# EAGLE design ic-mhm-encoder-buffer-output-only (EAGLE 9.6.2)
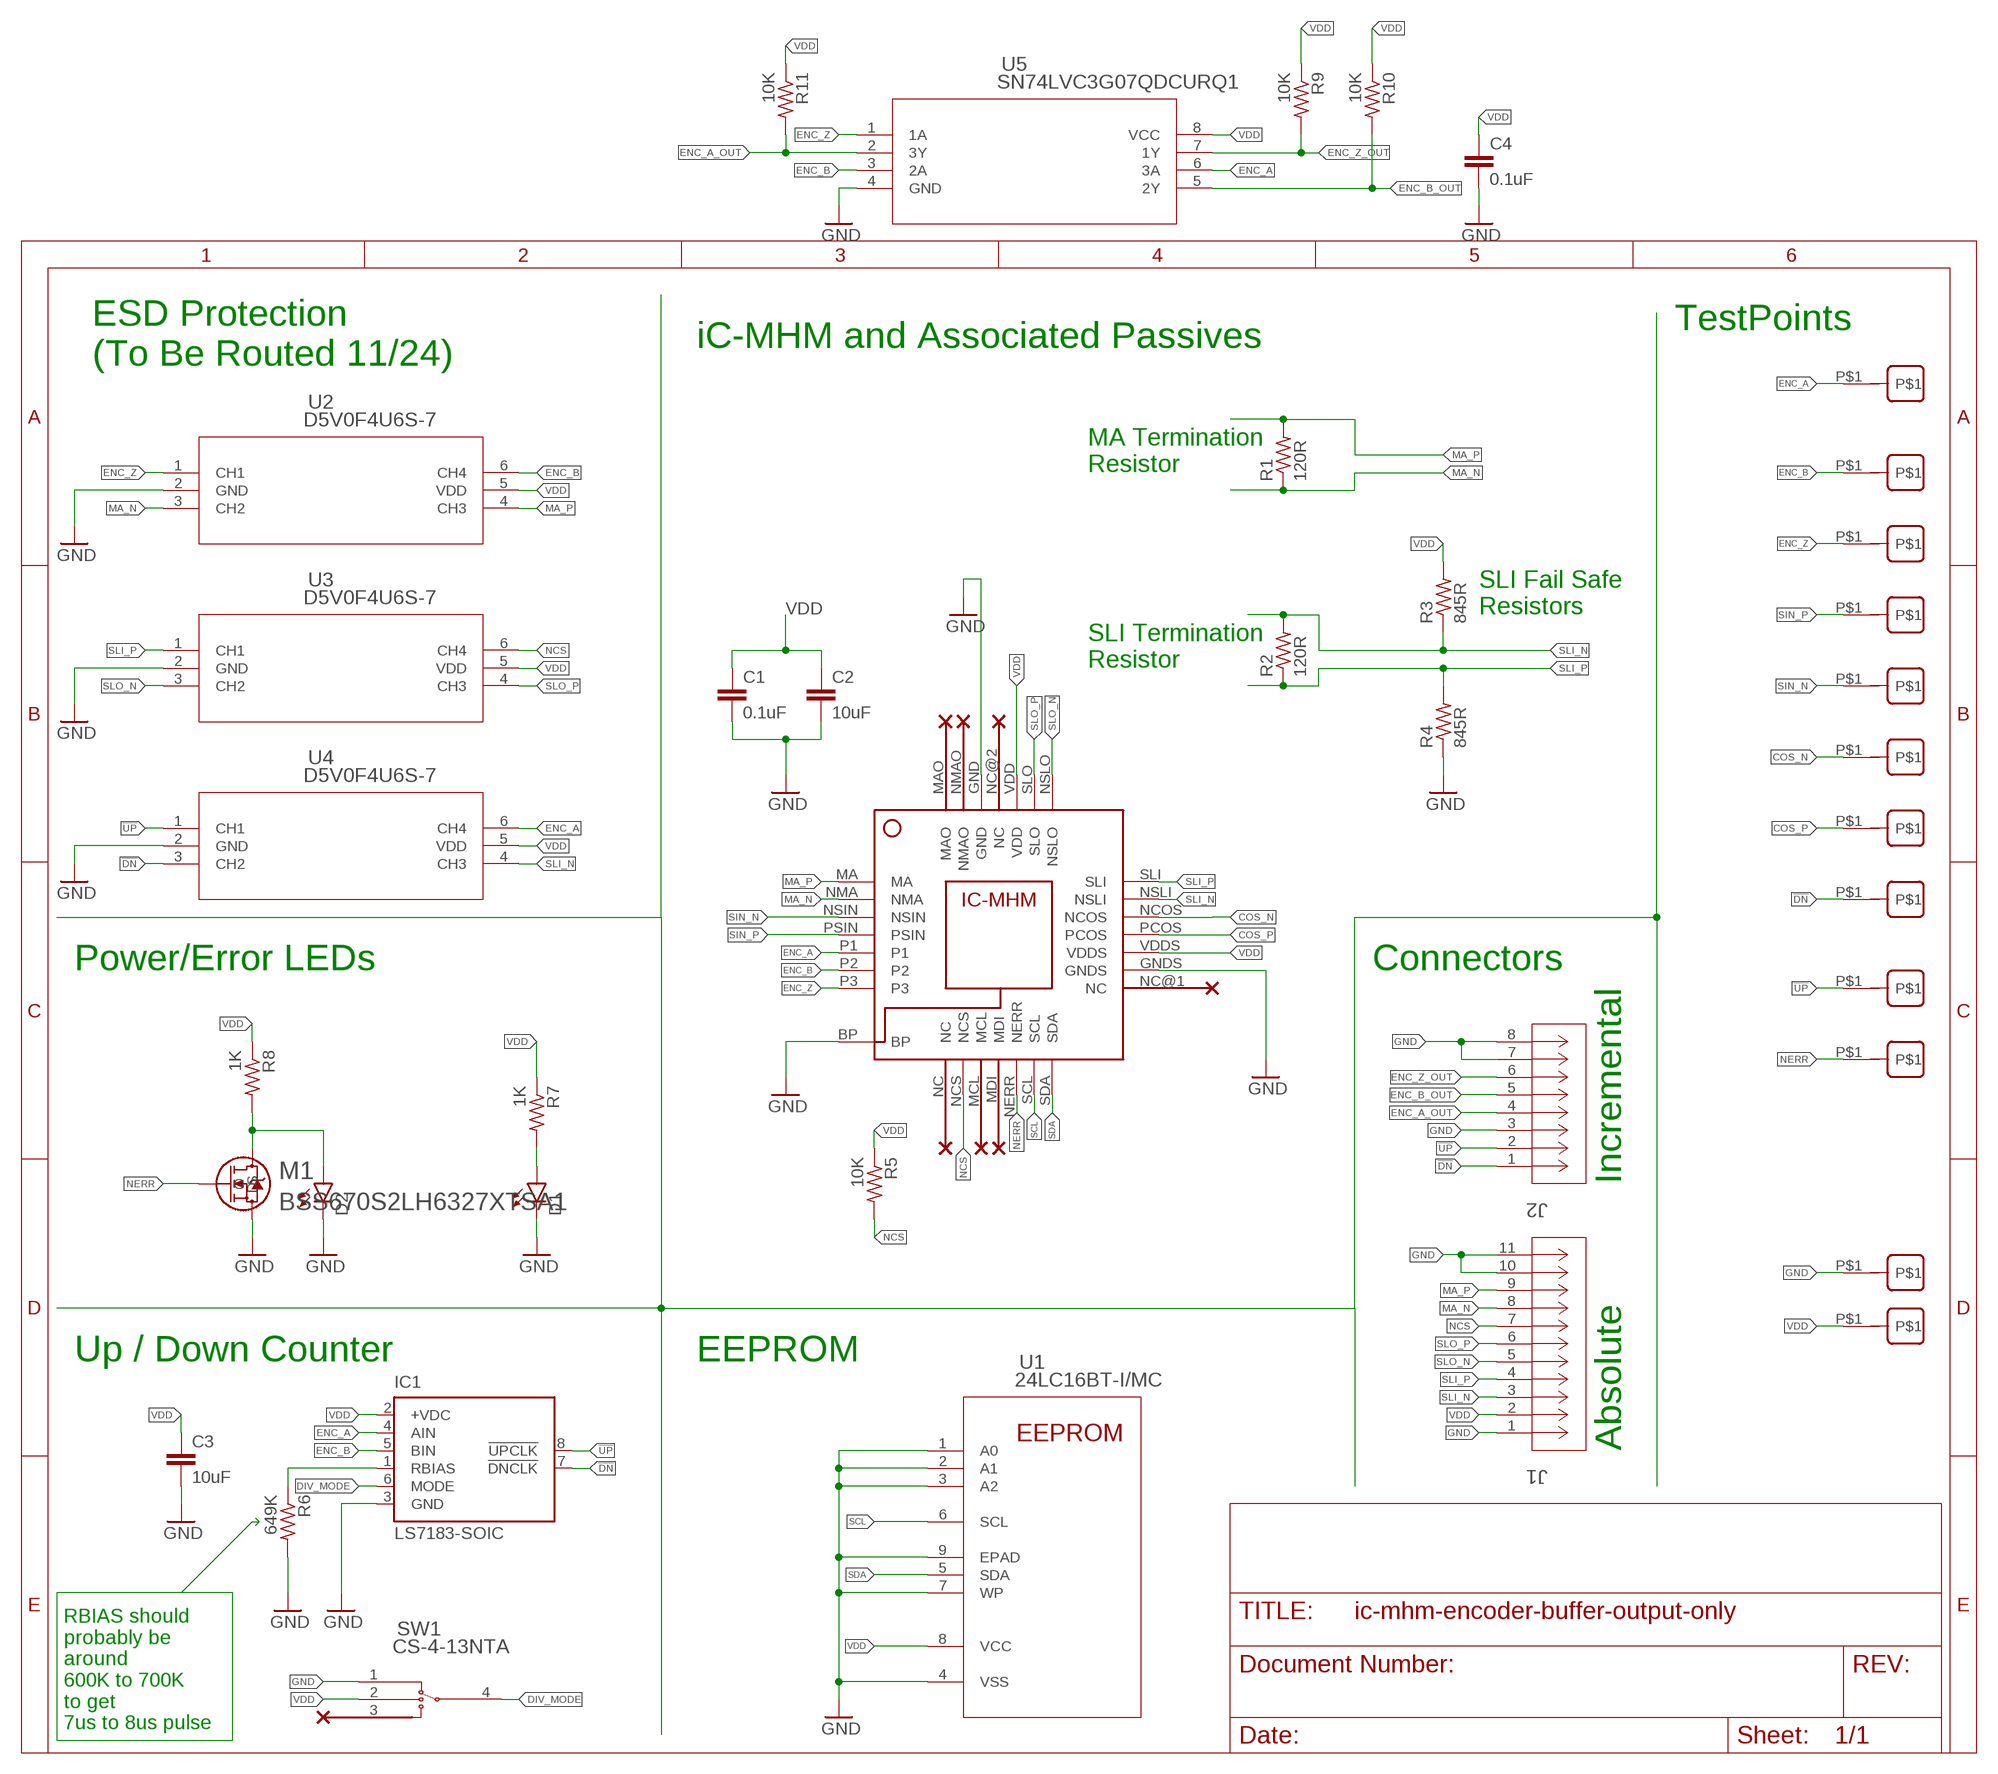
[diagram p0: schematic, sheet 1]

## Parts
C1  0.1uF  C-EUC0603  [C0603]
C2  10uF  C-EUC0805  [C0805]
C3  10uF  C-EUC0805  [C0805]
C4  0.1uF  C-EUC0603  [C0603]
D1  LEDSML0603  [SML0603]
D2  LEDSML0603  [SML0603]
IC1  LS7183-SOIC  [SOIC08]
J1  2023960907  [CON_2023960907]
J2  2023960607  [CON_2023960607]
M1  BSS670S2LH6327XTSA1  [PG-SOT23-3-5_INF]
R1  120R  R-US_R0603  [R0603]
R2  120R  R-US_R0603  [R0603]
R3  845R  R-US_R0603  [R0603]
R4  845R  R-US_R0603  [R0603]
R5  10K  R-US_R0603  [R0603]
R6  649K  R-US_R0603  [R0603]
R7  1K  R-US_R0603  [R0603]
R8  1K  R-US_R0603  [R0603]
R9  10K  R-US_R0603  [R0603]
R10  10K  R-US_R0603  [R0603]
R11  10K  R-US_R0603  [R0603]
SW1  CS-4-13NTA  [CS-4-13NA_NDC]
U1  24LC16BT-I/MC  [DFN8_2X3MC_MCH]
U2  D5V0F4U6S-7  [SOT-363_DIO]
U3  D5V0F4U6S-7  [SOT-363_DIO]
U4  D5V0F4U6S-7  [SOT-363_DIO]
U5  SN74LVC3G07QDCURQ1  [DCU8_TEX]
U$1  IC-MHM  [IC-MHM]
U$2  TESTPOINT_S1751-46  [TESTPOINT_S1751-46]
U$3  TESTPOINT_S1751-46  [TESTPOINT_S1751-46]
U$4  TESTPOINT_S1751-46  [TESTPOINT_S1751-46]
U$5  TESTPOINT_S1751-46  [TESTPOINT_S1751-46]
U$6  TESTPOINT_S1751-46  [TESTPOINT_S1751-46]
U$7  TESTPOINT_S1751-46  [TESTPOINT_S1751-46]
U$8  TESTPOINT_S1751-46  [TESTPOINT_S1751-46]
U$9  TESTPOINT_S1751-46  [TESTPOINT_S1751-46]
U$10  TESTPOINT_S1751-46  [TESTPOINT_S1751-46]
U$11  TESTPOINT_S1751-46  [TESTPOINT_S1751-46]
U$15  TESTPOINT_S1751-46  [TESTPOINT_S1751-46]
U$16  TESTPOINT_S1751-46  [TESTPOINT_S1751-46]

## Nets
!DN: IC1.7(!DNCLK) J2.1 U4.3(CH2) U$8.P$1
!UP: IC1.8(!UPCLK) J2.2 U4.1(CH1) U$9.P$1
COS_N [RS422]: U$1.NCOS U$7.P$1
COS_P [RS422]: U$1.PCOS U$11.P$1
DIV_MODE: IC1.6(MODE) SW1.4
ENC_A: IC1.4(AIN) U4.6(CH4) U5.6(3A) U$1.P1 U$2.P$1
ENC_A_OUT: J2.4 R11.2 U5.2(3Y)
ENC_B: IC1.5(BIN) U2.6(CH4) U5.3(2A) U$1.P2 U$3.P$1
ENC_B_OUT: J2.5 R10.2 U5.5(2Y)
ENC_Z: U2.1(CH1) U5.1(1A) U$1.P3 U$4.P$1
ENC_Z_OUT: J2.6 R9.2 U5.7(1Y)
GND: C1.2 C2.2 C3.2 C4.2 D1.C D2.C IC1.3(GND) J1.1 J1.10 J1.11 J2.3 J2.7 J2.8 M1.2(S) R4.1 R6.2 SW1.1 U1.1(A0) U1.2(A1) U1.3(A2) U1.4(VSS) U1.7(WP) U1.9(EPAD) U2.2(GND) U3.2(GND) U4.2(GND) U5.4(GND) U$1.BP U$1.GND U$1.GNDS U$15.P$1
MA_N [RS422]: J1.8 R1.1 U2.3(CH2) U$1.NMA
MA_P [RS422]: J1.9 R1.2 U2.4(CH3) U$1.MA
N$3: IC1.1(RBIAS) R6.1
N$4: D1.A R7.2
N$5: D2.A M1.3(D) R8.2
NCS: J1.7 R5.2 U3.6(CH4) U$1.NCS
NERR: M1.1(G) U$1.NERR U$10.P$1
SCL: U1.6(SCL) U$1.SCL
SDA: U1.5(SDA) U$1.SDA
SIN_N [RS422]: U$1.NSIN U$6.P$1
SIN_P [RS422]: U$1.PSIN U$5.P$1
SLI_N [RS422]: J1.3 R2.2 R3.1 U4.4(CH3) U$1.NSLI
SLI_P [RS422]: J1.4 R2.1 R4.2 U3.1(CH1) U$1.SLI
SLO_N [RS422]: J1.5 U3.3(CH2) U$1.NSLO
SLO_P [RS422]: J1.6 U3.4(CH3) U$1.SLO
VDD: C1.1 C2.1 C3.1 C4.1 IC1.2(+VDC) J1.2 R3.2 R5.1 R7.1 R8.1 R9.1 R10.1 R11.1 SW1.2 U1.8(VCC) U2.5(VDD) U3.5(VDD) U4.5(VDD) U5.8(VCC) U$1.VDD U$1.VDDS U$16.P$1
Unconnected: SW1.3 U$1.MAO U$1.MCL U$1.MDI U$1.NC U$1.NC@1(NC) U$1.NC@2(NC) U$1.NMAO

## Notes on the sheet
- TestPoints
- iC-MHM and Associated Passives
- ESD Protection
  (To Be Routed 11/24)
- MA Termination
  Resistor
- SLI Fail Safe 
  Resistors
- SLI Termination
  Resistor
- Power/Error LEDs | Connectors
- Incremental
- Up / Down Counter | EEPROM
- Absolute
- RBIAS should 
  probably be 
  around 
  600K to 700K
  to get 
  7us to 8us pulse

## Library data of the parts
C1-C4 = rcl:C-EU: CAPACITOR, European symbol; SPICEPREFIX: C
D1 D2 = led:LED: LED OSRAM: - CHIPLED LG R971, LG N971, LY N971, LG Q971, LY Q971, LO R971, LY R971 LH N974, LH R974 LS Q976, LO Q976, LY Q976 LO Q996 - Hyper CHIPLED LW Q18S LB Q993, LB Q99A, LB R99A - SideLED LS A670, LO A670, LY A670, LG A670, LP A670 LB A673, LV A673, LT A673, LW A673 LH A674 LY A675 LS A676, LA A676, LO A676, LY A676, LW A676 LS A679, LY A679, LG A679 - Hyper Micro SIDELED® LS Y876, LA Y876, LO Y876, LY Y876 LT Y87S - SmartLED LW L88C, LW L88S LB L89C, LB L89S, LG L890 LS L89K, LO L89K, LY L89K LS L896, LA L896, LO L896, LY L896 - TOPLED LS T670, LO T670, LY T670, LG T670, LP T670 LSG T670, LSP T670, LSY T670, LOP T670, LYG T670 LG T671, LOG T671, LSG T671 LB T673, LV T673, LT T673, LW T673 LH T674 LS T676, LA T676, LO T676, LY T676, LB T676, LH T676, LSB T676, LW T676 LB T67C, LV T67C, LT T67C, LS T67K, LO T67K, LY T67K, LW E67C LS E67B, LA E67B, LO E67B, LY E67B, LB E67C, LV E67C, LT E67C LW T67C LS T679, LY T679, LG T679 LS T770, LO T770, LY T770, LG T770, LP T770 LB T773, LV T773, LT T773, LW T773 LH T774 LS E675, LA E675, LY E675, LS T675 LS T776, LA T776, LO T776, LY T776, LB T776 LHGB T686 LT T68C, LB T68C - Hyper Mini TOPLED® LB M676 - Mini TOPLED Santana® LG M470 LS M47K, LO M47K, LY M47K Source: http://www.osram.convergy.de LUXEON: - LUMILED® LXK2-PW12-R00, LXK2-PW12-S00, LXK2-PW14-U00, LXK2-PW14-V00 LXK2-PM12-R00, LXK2-PM12-S00, LXK2-PM14-U00 LXK2-PE12-Q00, LXK2-PE12-R00, LXK2-PE12-S00, LXK2-PE14-T00, LXK2-PE14-U00 LXK2-PB12-K00, LXK2-PB12-L00, LXK2-PB12-M00, LXK2-PB14-N00, LXK2-PB14-P00, LXK2-PB14-Q00 LXK2-PR12-L00, LXK2-PR12-M00, LXK2-PR14-Q00, LXK2-PR14-R00 LXK2-PD12-Q00, LXK2-PD12-R00, LXK2-PD12-S00 LXK2-PH12-R00, LXK2-PH12-S00 LXK2-PL12-P00, LXK2-PL12-Q00, LXK2-PL12-R00 Source: www.luxeon.com KINGBRIGHT: KA-3528ASYC Source: www.kingbright.com
IC1 = LS7183:LS7183: Encoder to Counter Interface Source: http://www.usdigital.com/products/ls7183-ls7184/ls7183 ls7184 Data Sheet.pdf; DESCRIPTION: QUADRATURE CLOCK CONVERTER; DIGI-KEY_PART_NUMBER: 2808-LS7183N-S-ND; MF: LSI; MP: LS7183; PACKAGE: SOIC-8 LSI; PURCHASE-URL: https://pricing.snapeda.com/search/part/LS7183/?ref=eda
J1 = ic-mhm:2023960907; COPYRIGHT: Copyright (C) 2021 Ultra Librarian. All rights reserved.; DIGI-KEY_PART_NUMBER_1: WM26786TR-ND; DIGI-KEY_PART_NUMBER_2: WM26786CT-ND; DIGI-KEY_PART_NUMBER_3: WM26786DKR-ND; MANUFACTURER_PART_NUMBER: 2023960907; MFR_NAME: Molex Connector Corporation
J2 = ic-mhm:2023960607; COPYRIGHT: Copyright (C) 2021 Ultra Librarian. All rights reserved.; DIGI-KEY_PART_NUMBER_1: 2023960607-ND; MANUFACTURER_PART_NUMBER: 2023960607; MFR_NAME: Molex Connector Corporation
M1 = ic-mhm:BSS670S2LH6327XTSA1; COPYRIGHT: Copyright (C) 2021 Ultra Librarian. All rights reserved.; DIGI-KEY_PART_NUMBER_1: BSS670S2LH6327XTSA1TR-ND; DIGI-KEY_PART_NUMBER_2: BSS670S2LH6327XTSA1CT-ND; DIGI-KEY_PART_NUMBER_3: BSS670S2LH6327XTSA1DKR-ND; MANUFACTURER_PART_NUMBER: BSS670S2LH6327XTSA1; MFR_NAME: Infineon
R1-R11 = rcl:R-US_: RESISTOR, American symbol; SPICEPREFIX: R
SW1 = ic-mhm:CS-4-13NTA; COPYRIGHT: Copyright (C) 2021 Ultra Librarian. All rights reserved.; DIGI-KEY_PART_NUMBER_1: 563-1035-1-ND; DIGI-KEY_PART_NUMBER_2: 563-1035-2-ND; DIGI-KEY_PART_NUMBER_3: 563-1035-6-ND; MANUFACTURER_PART_NUMBER: CS-4-13NTA; MFR_NAME: Nidec Copal Electronics
U1 = ic-mhm:24LC16BT-I/MC; COPYRIGHT: Copyright (C) 2021 Ultra Librarian. All rights reserved.; DIGI-KEY_PART_NUMBER_1: 24LC16BT-I/MCCT-ND; DIGI-KEY_PART_NUMBER_2: 24LC16BT-I/MCDKR-ND; DIGI-KEY_PART_NUMBER_3: 24LC16BT-I/MCTR-ND; MANUFACTURER_PART_NUMBER: 24LC16BT-I/MC; MFR_NAME: Microchip
U2-U4 = ic-mhm:D5V0F4U6S-7; COPYRIGHT: Copyright (C) 2021 Ultra Librarian. All rights reserved.; DIGI-KEY_PART_NUMBER_1: 31-D5V0F4U6S-7CT-ND; DIGI-KEY_PART_NUMBER_2: 31-D5V0F4U6S-7DKR-ND; DIGI-KEY_PART_NUMBER_3: 31-D5V0F4U6S-7TR-ND; DIGI-KEY_PART_NUMBER_4: D5V0F4U6S-7-ND; DIGI-KEY_PART_NUMBER_5: D5V0F4U6S-7DICT-ND; DIGI-KEY_PART_NUMBER_6: D5V0F4U6S-7DIDKR-ND; DIGI-KEY_PART_NUMBER_7: D5V0F4U6S-7DITR-ND; MANUFACTURER_PART_NUMBER: D5V0F4U6S-7; MFR_NAME: Diodes Inc
U5 = ic-mhm:SN74LVC3G07QDCURQ1; COPYRIGHT: Copyright (C) 2021 Ultra Librarian. All rights reserved.; DIGI-KEY_PART_NUMBER_1: 296-23710-1-ND; DIGI-KEY_PART_NUMBER_2: 296-23710-2-ND; DIGI-KEY_PART_NUMBER_3: 296-23710-6-ND; DIGI-KEY_PART_NUMBER_4: 2156-SN74LVC3G07QDCURQ1-ND; MANUFACTURER_PART_NUMBER: SN74LVC3G07QDCURQ1; MFR_NAME: Texas Instruments
U$1 = ic-mhm:IC-MHM
U$2-U$11 U$15 U$16 = ic-mhm:TESTPOINT_S1751-46

## Net classes
1 RS422: width 0.159 mm, clearance 0.254 mm

## Board
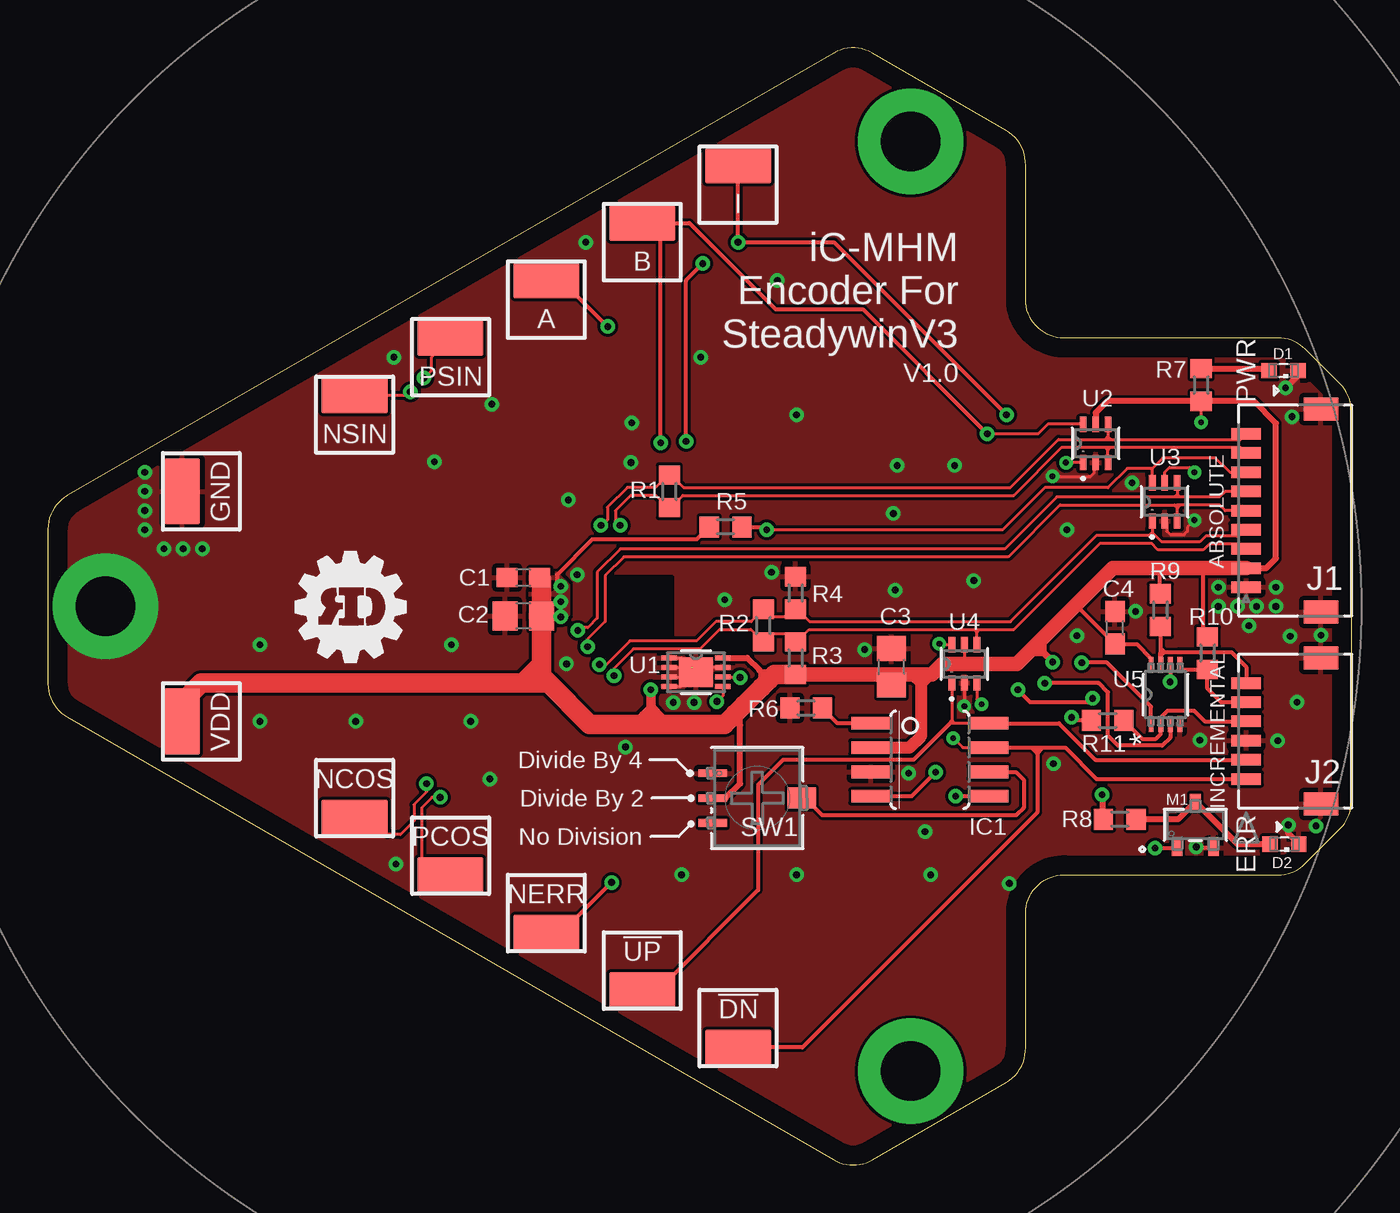
[diagram p1: board, top side]
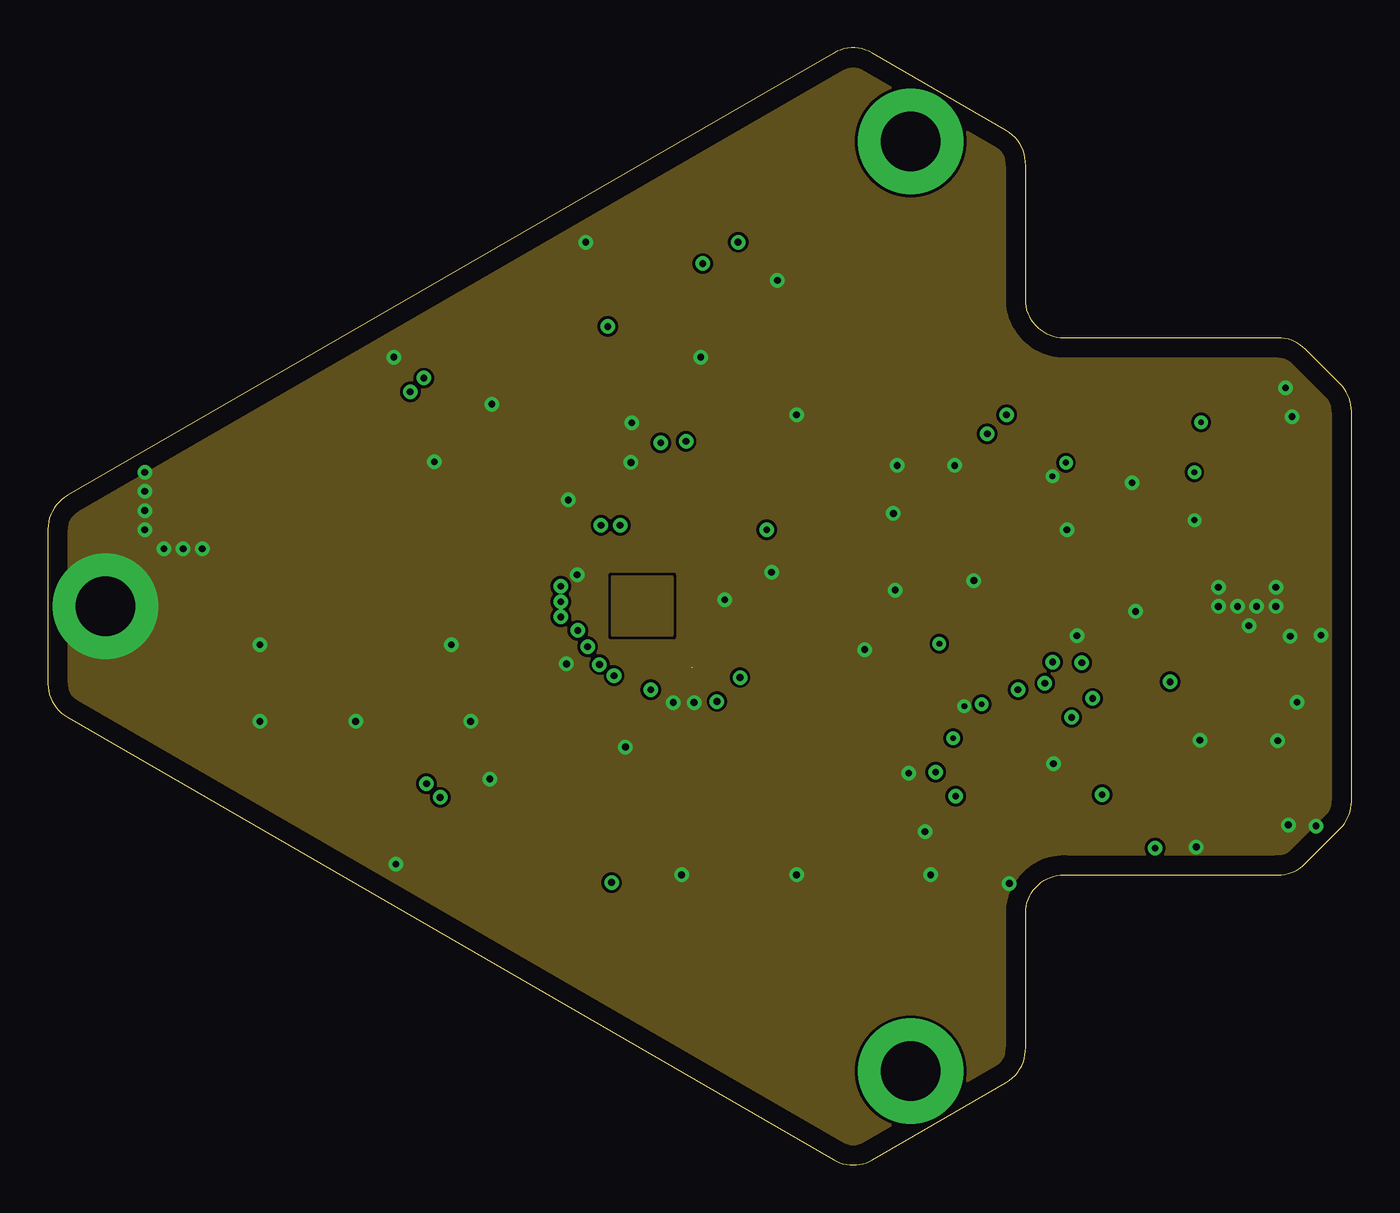
[diagram p2: board, inner layer Route2]
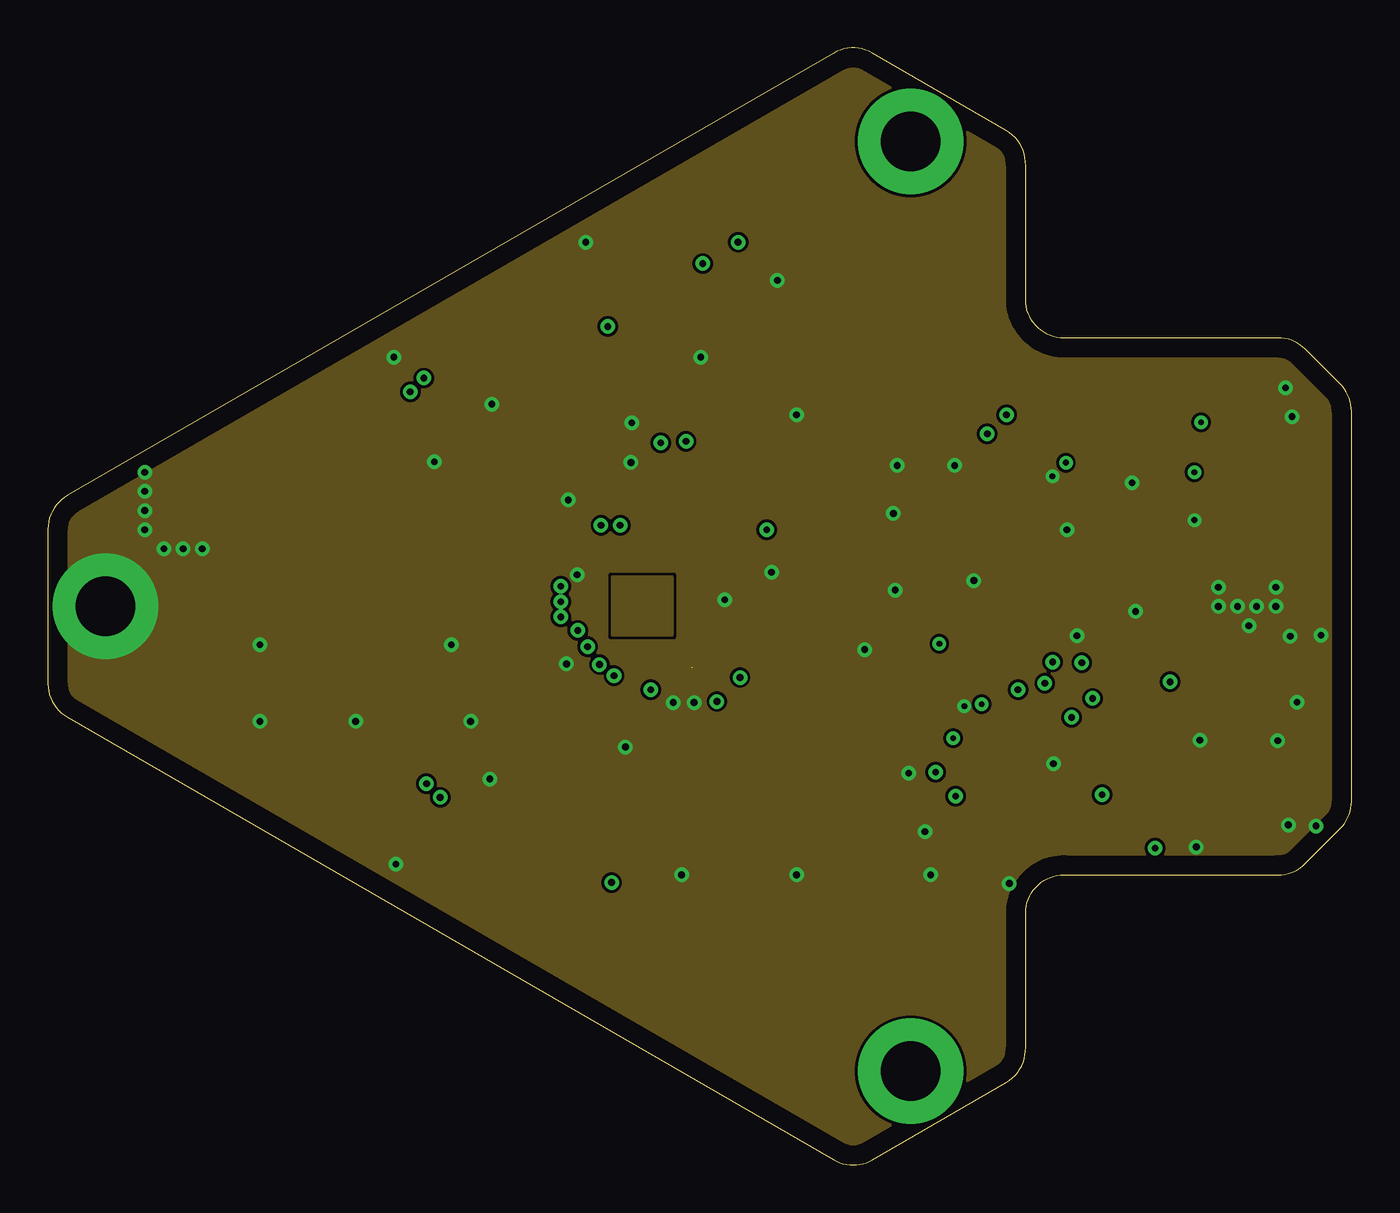
[diagram p3: board, inner layer Route15]
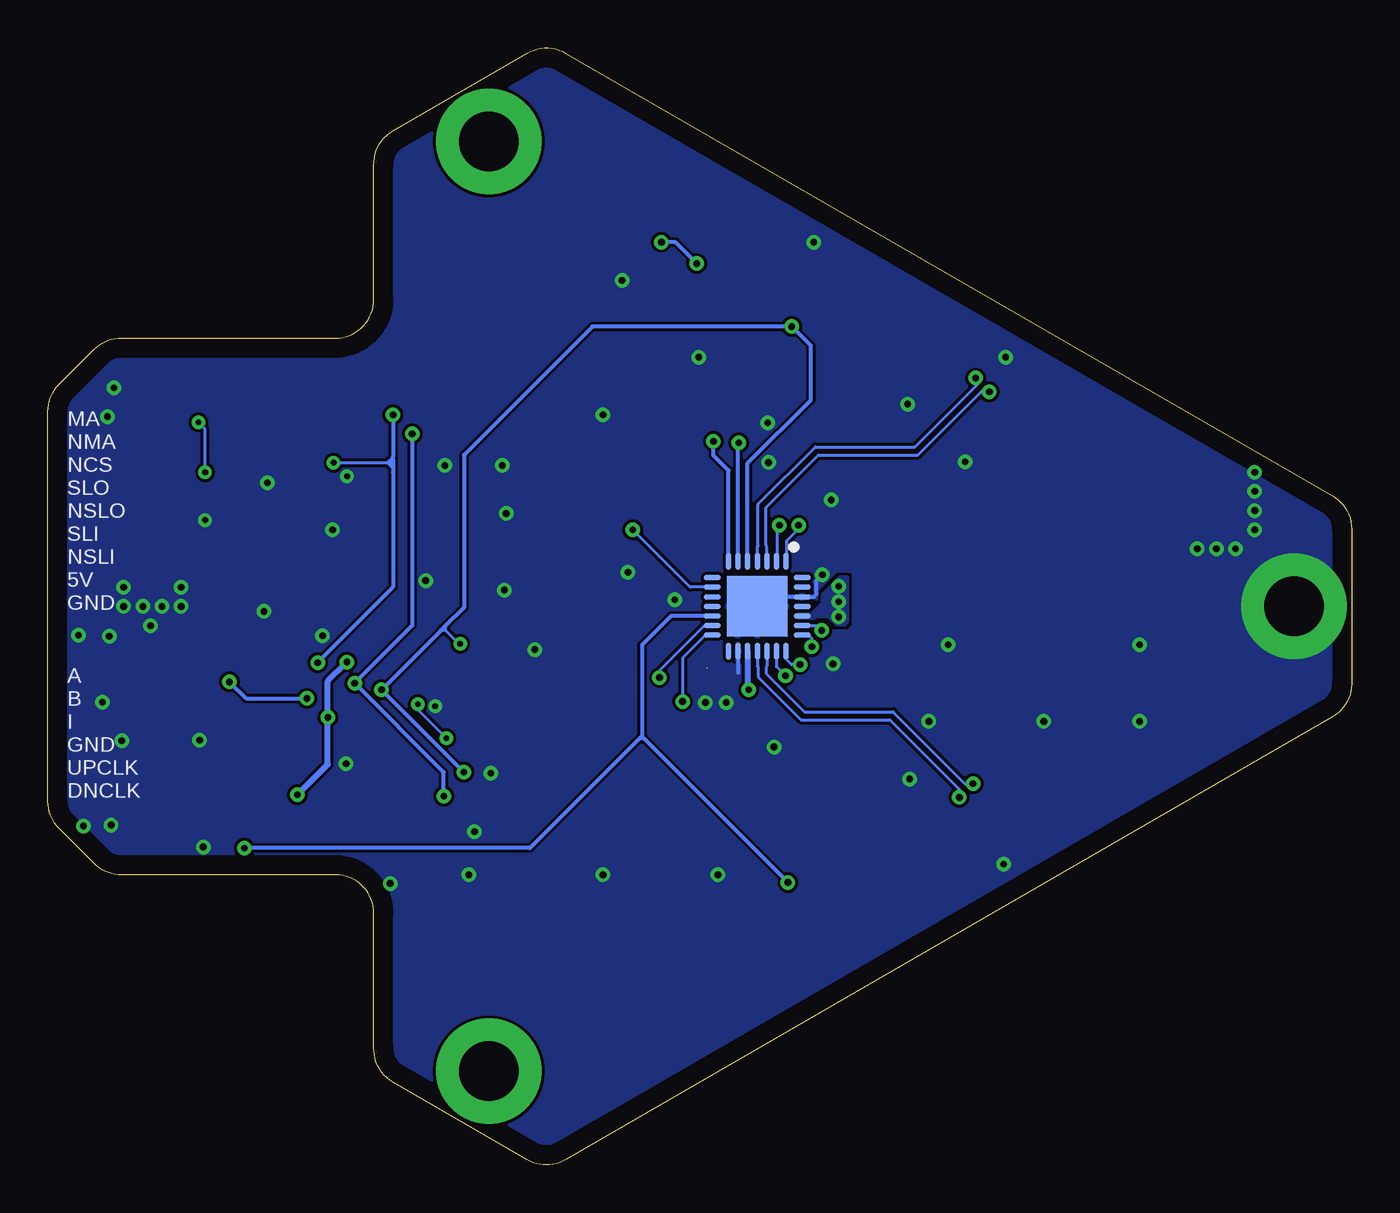
[diagram p4: board, bottom side, seen from below]

Size 68 x 58.27 mm. Coordinates in mm from the lower left corner, seen from the top.
Outline: 41,58 1,34.91 arc60 0,33.18 0,25.09 arc60 1,23.36 41,0.27 arc60 43,0.27 50,4.31 arc60 51,6.14 51,13.14 arc-90 53,15.14 64.17,15.14 arc45 65.59,15.72 67.41,17.55 arc45 68,18.96 68,39.31 arc45 67.41,40.72 65.59,42.55 arc45 64.17,43.14 53,43.14 arc-90 51,45.14 51,52.14 arc60 50,53.96 43,58 arc60 41,58
Copper layers (1+2*15+16): Top 0.035mm / dielectric 0.18mm / Route2 0.035mm / dielectric 1.5mm / Route15 0.035mm / dielectric 0.18mm / Bottom 0.035mm
Design rules "default *": minimum track width 6mil, minimum drill 0.3mm, track to track 6mil, track to pad 6mil, pad to pad 6mil, via to via 6mil, smd to smd 6mil, copper to edge 40mil, drill to drill 6mil, minimum pad ring 10mil, minimum via ring 8mil, stop-mask expansion 4mil, vias tented up to drill 25mil, thermal gap 10mil
tRestrict: area 29.5,27.7 to 32.5,30.7
bRestrict: 5 lines

### Footprints (pad centres in the part's own frame; a part is rotated, then mirrored left to right if it is on the bottom)
C0603 = smd 1.1 x 1: 1 -0.85,0; 2 0.85,0
C0805 = smd 1.3 x 1.5: 1 -0.95,0; 2 0.95,0
SML0603 = smd 0.8 x 0.8: A 0.75,0; C -0.75,0
SOIC08 = smd 0.66 x 2.032: 1 -1.905,-3.073; 2 -0.635,-3.073; 3 0.635,-3.073; 4 1.905,-3.073; 5 1.905,3.073; 6 0.635,3.073; 7 -0.635,3.073; 8 -1.905,3.073
CON_2023960907 = smd 0.6 x 1.55: 1 0,0; 2 1,0; 3 2,0; 4 3,0; 5 4,0; 6 5,0; 7 6,0; 8 7,0; 9 8,0 | smd 1.2 x 1.8: 10 -1.3,-3.9; 11 9.3,-3.9
CON_2023960607 = smd 0.6 x 1.55: 1 0,0; 2 1,0; 3 2,0; 4 3,0; 5 4,0; 6 5,0 | smd 1.2 x 1.8: 7 -1.3,-3.9; 8 6.3,-3.9
PG-SOT23-3-5_INF = smd 0.568 x 0.852: 1 -0.95,-1.194; 2 0.95,-1.194; 3 0,1.194
R0603 = smd 1 x 1.1: 1 -0.85,0; 2 0.85,0
CS-4-13NA_NDC = smd 0.408 x 1.472: 1 -1.3,-2.317; 2 0,-2.317; 3 1.3,-2.317 | smd 1.094 x 1.472: 4 0,2.317
DFN8_2X3MC_MCH = smd 0.808 x 0.255: 1 -1.395,0.75; 2 -1.395,0.25; 3 -1.395,-0.25; 4 -1.395,-0.75; 5 1.395,-0.75; 6 1.395,-0.25; 7 1.395,0.25; 8 1.395,0.75 | smd 1.753 x 1.549: 9 0,0
SOT-363_DIO = smd 0.8 x 0.42: 1 -1,0.65; 2 -1,0; 3 -1,-0.65; 4 1,-0.65; 5 1,0; 6 1,0.65
DCU8_TEX = smd 0.756 x 0.254: 1 -1.572,0.75; 2 -1.572,0.25; 3 -1.572,-0.25; 4 -1.572,-0.75; 5 1.572,-0.75; 6 1.572,-0.25; 7 1.572,0.25; 8 1.572,0.75
IC-MHM = smd 3.15 x 3.15: BP 0,0 | smd 0.3 x 0.9: GND -0.5,2.35; MAO -1.5,2.35; MCL -0.5,-2.35; MDI 0,-2.35; NC -1.5,-2.35; NC@2 0,2.35; NCS -1,-2.35; NERR 0.5,-2.35; NMAO -1,2.35; NSLO 1.5,2.35; SCL 1,-2.35; SDA 1.5,-2.35; SLO 1,2.35; VDD 0.5,2.35 | smd 0.9 x 0.3: GNDS 2.35,-1; MA -2.35,1.5; NC@1 2.35,-1.5; NCOS 2.35,0.5; NMA -2.35,1; NSIN -2.35,0.5; NSLI 2.35,1; P1 -2.35,-0.5; P2 -2.35,-1; P3 -2.35,-1.5; PCOS 2.35,0; PSIN -2.35,0; SLI 2.35,1.5; VDDS 2.35,-0.5
TESTPOINT_S1751-46 = smd 3.45 x 1.85: P$1 0,0

### Placement (x,y rotation side)
C1  24.8,30.64 180 top
C2  24.8,28.64 180 top
C3  44,25.99 90 top
C4  55.66,28.02 90 top
D1  64.45,41.44 180 top
D2  64.5,16.74 180 top
IC1  46,21.14 270 top
J1  62.5,30.14 90 top
J2  62.5,20.14 90 top
M1  59.85,17.74 0 top
R1  32.42,35.14 90 top
R2  37.31,28.14 270 top
R3  39,26.44 270 top
R4  39,29.84 270 top
R5  35.35,33.29 0 top
R6  39.55,23.84 180 top
R7  60.15,40.69 90 top
R8  55.91,18.03 0 top
R9  58.03,28.94 270 top
R10  60.49,26.7 270 top
R11  55.27,23.18 0 top
SW1  37,19.14 270 top
U1  33.8,25.7 0 top
U2  54.65,37.64 90 top
U3  58.25,34.59 90 top
U4  47.8,26.14 90 top
U5  58.29,24.54 90 top
U$1  31,29.14 270 bottom
U$2  26,46.14 0 top
U$3  31,49.14 0 top
U$4  36,52.14 0 top
U$5  21,43.14 0 top
U$6  16,40.14 0 top
U$7  16,18.14 0 top
U$8  36,6.14 0 top
U$9  31,9.14 0 top
U$10  26,12.14 0 top
U$11  21,15.14 0 top
U$15  7,35.14 90 top
U$16  7,23.14 90 top

### Tracks (layer width: path | path; a pad name or v marks a point on that pad's centre or on a via)
!DN  (via drill 0.3)
  Top 0.159: U4.3 48.45,24.29 v48.7,24.04 | v47.22,22.26 47.71,21.77 IC1.7
  Top 0.203: J2.1 54.7,20.14 53.06,21.77 51.9,21.77 | IC1.7 51.3,21.77 | 51.3,21.77 51.6,21.77 | 51.6,21.77 51.9,21.77 | 51.3,21.77 51.61,21.46 | U$8.P$1 39.35,6.14 51.61,18.39 51.61,21.46 | 51.61,21.46 51.61,21.48 | 51.61,21.48 51.9,21.77 | 51.61,21.48 51.61,21.76 51.6,21.77
  Bottom 0.159: v48.7,24.04 48.7,23.74 v47.22,22.26
!UP
  Top 0.159: U4.1 47.15,23.19 | 47.15,23.19 47.15,23.09 47.12,23.11 | IC1.8 47.29,23.04 | 47.29,23.04 47.15,23.19 | 47.29,23.04 47.05,23.04 47,22.99
  Top 0.203: IC1.8 52.73,23.04 54.64,21.14 J2.2 | U$9.P$1 31.85,9.14 37.05,14.34 37.05,19.84 38.35,21.14 45.15,21.14 47,22.99 47.12,23.11
COS_N  (via drill 0.35)
  Top 0.159: v19.75,19.89 19.75,19.47 19.09,18.81 19.09,17.94 18.39,17.24 17.7,17.24 16.8,18.14 U$7.P$1
  Bottom 0.159: U$1.NCOS 30.5,26.02 30.54,25.97 30.54,25.64 28.54,23.64 23.92,23.64 20.17,19.89 v19.75,19.89
COS_P  (via drill 0.35)
  Top 0.159: v20.46,19.17 20.04,19.17 19.5,18.64 19.5,16.04 20.4,15.14 U$11.P$1
  Bottom 0.159: U$1.PCOS 31,26.02 30.96,25.97 30.96,25.46 28.71,23.22 24.09,23.22 20.46,19.6 v20.46,19.17
DIV_MODE
  Top 0.203: SW1.4 39.5,19.14 40.4,18.24 50.5,18.24 50.9,18.64 50.9,20.09 50.48,20.5 IC1.6
ENC_A  (via drill 0.3, 0.35)
  Top 0.159: U4.6 46.55,27.14 v46.5,27.19
  Top 0.203: v29.2,43.74 26.8,46.14 U$2.P$1 | v46.3,20.49 45.04,19.23 IC1.4 | v50.6,24.79 51.25,24.14 54.29,24.14 v54.49,24.34 | U5.6 58.54,25.21 v58.53,25.2
  Bottom 0.159: v46.5,27.19 46.55,27.19 47.25,27.89 | 47.25,27.89 47.37,28.01 | 47.25,27.89 47.25,28.09 47.27,28.11 | 47.25,27.89 47.5,27.89
  Bottom 0.203: v46.3,20.49 v50.6,24.79 47.5,27.89 47.37,28.01 47.27,28.11 46.3,29.09 46.3,37.04 39.6,43.74 v29.2,43.74 28.21,42.74 28.21,39.91 31.5,36.61 U$1.P1 | v58.53,25.2 57.67,24.34 v54.49,24.34
ENC_A_OUT
  Top 0.203: J2.4 60.34,23.14 59.78,23.7 58.41,23.7 58.04,23.34 U5.2 58.04,22.47 57.8,22.23 57.08,22.23 R11.2
ENC_B  (via drill 0.35)
  Top 0.159: U2.6 52.15,38.64 51.65,38.14 v49,38.14
  Top 0.203: 32.02,49.14 32.29,49.14 33.45,49.14 37.95,44.64 42.5,44.64 v49,38.14 | IC1.5 v47.35,19.23 v47.35,19.24 | v31.96,37.67 31.96,49.08 32.02,49.14 | U5.3 58.54,22.29 58.13,21.87 55.82,21.87 55.29,22.39 55.29,24.66 54.82,25.14 v52,25.14 | U$3.P$1 32.02,49.14
  Bottom 0.203: v49,38.14 49,28.14 v52,25.14 47.35,20.49 v47.35,19.24 | U$1.P2 32,37.64 v31.96,37.67
ENC_B_OUT
  Top 0.203: U5.5 59.04,25.86 59.05,25.85 R10.2 60.49,24.85 61.2,24.14 J2.5
ENC_Z  (via drill 0.3, 0.35)
  Top 0.159: U2.1 v53.1,36.64
  Top 0.203: U$4.P$1 v36,48.14 41,48.14 v50,39.14 | v34.15,47.02 33.29,46.15 v33.29,37.75 | U5.1 57.54,23.9 55.24,26.2 v53.93,26.2
  Bottom 0.159: v53.1,36.64 50.3,36.64 | 50.3,36.64 50.15,36.64 | 50.15,36.64 50,36.79 | 50,36.94 50.3,36.64 | 50.15,36.64 50,36.49 | 50,36.14 50,36.34 50.3,36.64
  Bottom 0.203: v50,39.14 50,36.94 50,36.79 50,36.49 50,36.14 50,30.14 v53.93,26.21 v53.93,26.2 | v34.15,47.02 35.27,48.14 v36,48.14 | U$1.P3 32.5,36.22 33.29,37.01 v33.29,37.75
ENC_Z_OUT
  Top 0.203: R9.2 58.03,26.96 | 58.03,26.96 58.24,26.75 58.06,26.57 | J2.6 62.5,25.98 61.73,26.75 58.99,26.75 58.98,26.74 58.03,26.74 | 58.03,26.13 58.06,26.16 58.06,26.57 | 58.06,26.57 58.04,26.55 U5.7 58.03,26.13 | 58.03,26.96 58.03,26.74 | 58.03,26.13 58.03,26.74
GND  (via drill 0.3, 0.35, 3.1 pad 5.5)  (1 unrouted)
  Top 0.152: U1.7 35.19,25.94 33.59,25.94 | U1.9 33.55,25.96 33.55,26.34 | U1.1 33.05,26.45 U1.9 | 33.63,25.93 32.43,25.93 U1.2 | U1.3 33.55,25.45 U1.9 | 34.08,26.03 33,24.95 U1.4 | 33.07,25.7 U1.9 | U3.2 58.36,33.48 58.36,33.07 58.55,32.88 59.25,32.88 59.44,33.07 59.44,33.28 v59.8,33.64
  Top 0.159: U4.2 v47.8,23.94 | U2.2 54.55,36.54 54.55,36.09 54.35,35.89 52.43,35.89 v52.4,35.92
  Top 0.203: M1.2 59.94,16.54 v59.9,16.59
  Top 0.305: D1.C 65.2,41.19 v64.55,40.54 | D2.C 64.7,17.29 v64.7,17.74
  Bottom 0.152: U$1.BP 30.65,29.49 30.65,29.74
  Bottom 0.203: 30.65,29.74 30.55,29.64 U$1.GND 28.05,29.64 27.9,29.79 27.9,30.49 v27.6,30.79 | U$1.GNDS 32,25.69
  other vias: 3,29.14 44.9,20.44 56.55,35.59 47.3,36.49 48.3,30.49 35.3,29.49 27.05,26.14 23.05,20.14 22.05,23.14 5.05,36.14 5.05,35.14 5.05,34.14 5.05,33.14 6.05,32.14 7.05,32.14 8.05,32.14 64.05,30.14 64.05,29.14 63.05,29.14 62.05,29.14 61.05,29.14 61.05,30.14 62.64,28.13 32.63,24.13 33.7,24.13 44.1,33.99 44.3,36.49 18.05,42.14 28.05,48.14 30.46,38.72 34.05,42.14 21.05,27.14 11.05,27.14 11.05,23.14 16.05,23.14 33.05,15.14 39.05,15.14 46.05,15.14 45.75,17.39 52.45,20.94 60.09,22.16 65.15,24.14 64.15,22.14 53.15,33.14 64.9,39.04 64.8,27.59 66.4,27.64 66.15,17.69 50.15,14.69 53.68,27.61 44.2,29.99 27.15,34.69 20.15,36.69 23.15,39.69 18.15,15.69 38.05,46.14 39.05,39.14 37.74,30.91 42.6,26.89 30.13,21.8 30.41,36.64 56.74,28.87
  pour Bottom (rank 5): -4,59.14 71,59.14 71,-5.86 -4,-5.86
  pour Route2 (rank 5): -4,59.14 -4,-5.86 76,-5.86 76,59.14
  pour Route15 (rank 5): -4,59.14 -4,-5.86 81,-5.86 81,59.14
  pour Top (rank 5): -4,59.14 -4,-5.86 86,-5.86 86,59.14
MA_N  (via drill 0.35)
  Top 0.159: v29.85,33.37 29.6,33.61 29.6,34.14 30.39,34.93 31.72,34.93 32.36,34.29 R1.1 32.47,34.29 33.11,34.93 50.38,34.93 52.88,37.44 55.15,37.44 | 55.15,37.44 55.3,37.44 | 55.3,37.44 55.45,37.44 | 55.45,37.44 62.2,37.44 J1.8 | U2.3 55.3,37.29 | 55.3,37.44 55.3,37.29 | 55.15,37.44 55.3,37.29 | 55.3,37.29 55.45,37.44
  Bottom 0.159: U$1.NMA 29.98,31.5 29.98,33.23 v29.85,33.37
MA_P  (via drill 0.35)
  Top 0.159: v28.85,33.37 28.91,33.37 29.19,33.65 29.19,34.31 30.22,35.34 31.69,35.34 32.34,35.99 R1.2 32.52,35.99 33.16,35.34 50.21,35.34 52.71,37.85 55.15,37.85 | 55.15,37.85 55.3,37.85 | 55.3,37.85 55.45,37.85 | 55.45,37.85 62.21,37.85 J1.9 | U2.4 55.3,38 | 55.3,38 55.3,37.85 | 55.3,38 55.15,37.85 | 55.3,38 55.45,37.85
  Bottom 0.159: v28.85,33.37 28.85,33.17 29.47,32.54 29.47,31.51 U$1.MA
N$1  (via drill 3.1 pad 5.5)
  other vias: 45,53.38
N$2  (via drill 3.1 pad 5.5)
  other vias: 45,4.89
N$3
  Top 0.203: IC1.1 41.19,23.04 R6.1
N$4
  Top 0.305: R7.2 63.6,41.54 D1.A
N$5
  Top 0.305: R8.2 58.96,18.04 M1.3 62.04,16.74 D2.A
NCS  (via drill 0.35)
  Top 0.152: U3.6 57.6,36.34
  Top 0.159: v37.5,33.14 49.8,33.14 52,35.34 55.3,35.34 56.3,36.34 57.6,36.34 58.15,36.89 60.9,36.89 61.65,36.14 J1.7
  Top 0.203: R5.2 37.35,33.29 v37.5,33.14
  Bottom 0.159: U$1.NCS 34.5,30.14 v37.5,33.14
NERR  (via drill 0.35)
  Top 0.203: v29.4,14.74 26.8,12.14 U$10.P$1 | v57.75,16.53 58.89,16.53 M1.1
  Bottom 0.203: U$1.NERR 35.5,28.64 37,27.14 37,22.34 | 37,22.34 36.9,22.24 | 37,22.34 37.02,22.36 37.15,22.24 | 36.9,22.24 v29.4,14.74 | 37.15,22.24 42.86,16.53 v57.75,16.53 | 36.9,22.24 37.15,22.24
NOT_GND
  pour Route2: 29.48,30.68 32.52,30.68 32.52,27.64 29.48,27.64
  pour Route15: 29.48,30.68 32.52,30.68 32.52,27.64 29.48,27.64
SCL  (via drill 0.35)
  Top 0.159: v36.1,25.43 35.22,25.43 U1.6
  Bottom 0.159: U$1.SCL 33.75,28.14 36.1,25.78 v36.1,25.43
SDA  (via drill 0.35)
  Top 0.159: U1.5 35.2,24.48 v34.9,24.18
  Bottom 0.159: U$1.SDA 33.7,27.64 34.9,26.44 v34.9,24.18
SIN_N  (via drill 0.35)
  Top 0.159: v18.9,40.33 18.7,40.14 U$6.P$1
  Bottom 0.159: U$1.NSIN 30.5,32.25 30.54,32.3 30.54,34.29 27.8,37.04 22.62,37.04 19.11,40.54 v18.9,40.33
SIN_P  (via drill 0.35)
  Top 0.159: v19.61,41.05 20,41.44 20,42.14 U$5.P$1
  Bottom 0.159: U$1.PSIN 31,32.25 30.96,32.3 30.96,34.46 27.97,37.45 22.79,37.45 19.4,40.84 v19.61,41.05
SLI_N  (via drill 0.35)
  Top 0.159: v29.53,25.53 29.53,25.91 30.54,26.92 34.02,26.92 35.04,27.94 36.66,27.94 R2.2 37.72,27.69 38.59,27.69 R3.1 39.06,27.29 39.71,27.93 48.3,27.93 | 48.3,27.93 48.6,27.93 | 48.6,27.93 50.38,27.93 54.88,32.44 57.55,32.44 57.9,32.08 60.26,32.08 60.57,32.39 62.02,32.39 62.27,32.14 J1.3 | U4.4 48.45,27.78 | 48.6,27.93 48.45,27.78 | 48.45,27.78 48.3,27.93
  Bottom 0.159: U$1.NSLI 30,26 v29.53,25.53
SLI_P  (via drill 0.35)
  Top 0.159: v28.77,26.1 29.12,26.1 30.36,27.34 33.84,27.34 34.84,28.35 36.68,28.35 R2.1 37.72,28.58 38.59,28.58 R4.2 39.09,28.99 39.73,28.34 50.21,28.34 54.71,32.85 57.45,32.85 | 57.6,32.85 57.75,32.85 | J1.4 62.32,33.14 61.99,32.81 60.39,32.81 60.08,32.5 58.1,32.5 57.75,32.85 | U3.1 57.6,33 | 57.6,33 57.6,32.99 | 57.6,32.99 57.6,32.85 | 57.45,32.85 57.6,32.85 | 57.45,32.85 57.59,32.99 57.6,32.99 | 57.6,33 57.75,32.85
  Bottom 0.159: v28.77,26.1 29.22,26.1 29.5,26.39 U$1.SLI
SLO_N  (via drill 0.35)
  Top 0.159: J1.5 61.41,34.14 61.11,34.43 59.05,34.43 | 59.05,34.43 58.9,34.43 | 58.76,34.43 52.79,34.43 50.09,31.72 30.04,31.72 29.06,30.75 29.06,28.35 28.15,27.43 v28.15,27.03 | 58.76,34.43 58.9,34.43 | 58.9,34.43 58.9,34.29 | U3.3 58.9,34.28 | 58.9,34.28 58.9,34.29 | 58.9,34.29 58.76,34.43 | 58.9,34.28 59.05,34.43
  Bottom 0.159: U$1.NSLO 28.33,27.64 28.15,27.45 v28.15,27.03
SLO_P  (via drill 0.35)
  Top 0.159: J1.6 61.41,35.14 61.11,34.84 59.05,34.84 | 59.05,34.84 58.9,34.84 | 58.9,34.84 58.75,34.84 | 58.75,34.84 52.62,34.84 49.92,32.14 29.87,32.14 28.65,30.92 28.65,28.52 28.16,28.04 27.8,28.04 v27.64,27.88 | U3.4 58.9,34.99 | 58.9,34.99 58.9,34.84 | 58.75,34.84 58.9,34.99 | 58.9,34.99 59.05,34.84
  Bottom 0.159: U$1.SLO 27.9,28.14 v27.64,27.88
VDD  (via drill 0.3, 0.35)
  Top 0.152: 37.23,25.38 37.23,24.91 37.12,25.02 37.12,25.8 37.68,25.8 37.9,25.59 | 37.1,25.82 37.23,25.69 37.23,25.38 | 37.38,25.54 37.23,25.38
  Top 0.159: U3.5 58.25,36.14 58.5,36.39 59.55,36.39 v59.8,36.14 | v60.15,38.74 R7.1 | C3.1 44,25.59 | U4.5 47.8,26.24 47.9,26.14
  Top 0.203: R5.1 33.84,32.63 28.39,32.63 26.55,30.79 26.55,30.39 v26.75,30.19 | U5.8 57.54,26.42 56.79,27.17 C4.1 53.63,29.2 53.63,29.21 | R11.1 53.56,23.18 v53.4,23.34 | R9.1 58,29.82 58,31.14 | R10.1 60.26,27.77 60.26,31.14
  Top 0.305: U1.8 36.47,26.45 37.1,25.82 37.12,25.8 37.38,25.54 37.62,25.3 | J1.2 63.55,31.14 64.05,31.64 64.05,38.69 62.9,39.84 R7.1 55.25,39.84 54.65,39.24 U2.5 | v54.99,19.31 54.99,18.1 R8.1 | 51.65,27.24 51.65,27.04 51.95,26.74 | 51.95,26.74 51.95,27.54 | 51.95,26.74 52.4,26.29 v52.4,26.24 51.95,26.69 51.1,26.69 | SW1.2 35.35,19.14 36.1,19.89 36.1,22.94 | 35.85,23.54 35.85,23.19 36.1,22.94 | 36.1,22.94 36.1,23.79 36.3,23.99
  Top 0.508: 31.47,23.83 31.47,23.73 31.07,23.33 31.07,23.46 | 31.45,23.86 31.45,23.83 31.07,23.46 | 31.45,23.86 v31.45,24.79 | 30.59,22.98 31.07,23.46 | 31.45,23.86 31.47,23.83 | 31.47,23.83 31.95,23.36 31.95,22.98
  Top 0.635: IC1.2 44.93,21.77 45.55,22.39 45.55,25.14 | 45.55,25.14 45.55,25.59 | 45.55,25.14 45.1,25.59 44.95,25.59 | 45.55,25.14 46,25.59 46.1,25.59
  Top 0.762: J1.2 60.26,31.14 58,31.14 55.55,31.14 53.63,29.21 51.95,27.54 51.65,27.24 51.1,26.69 50.55,26.14 47.9,26.14 46.65,26.14 46.1,25.59 45.55,25.59 44.95,25.59 44,25.59 R3.2
  Top 1.016: R3.2 37.9,25.59 37.62,25.3 37.23,24.91 36.3,23.99 35.85,23.54 35.29,22.98 31.95,22.98 30.59,22.98 28.26,22.98 26.05,25.19 | 25.75,26.14 25.75,25.49 26.05,25.19 | 25.75,26.14 C2.1 25.75,30.54 C1.1 | 25.75,26.14 24.75,25.14 | U$16.P$1 7,24.14 8,25.14 24.75,25.14 | 24.75,25.14 26,25.14 26.05,25.19
  Bottom 0.159: v59.8,36.14 59.8,38.39 v60.15,38.74
  Bottom 0.203: 31.5,24.84 v31.45,24.79
  Bottom 0.305: U$1.VDDS 31.5,24.84 | v54.99,19.31 53.4,20.9 v53.4,23.34 53.4,25.24 v52.4,26.24
  other vias: 26.75,29.39 26.75,28.59
  pour Top: 25.15,31.09 26.35,31.09 27.15,30.29 27.15,28.69 26.4,27.94 25.15,27.94
  pour Bottom (no thermals): 28.9,28.74 28.2,28.74 28.05,28.89 27.6,29.34 27.6,29.79 26.7,30.69 26.3,30.69 26.3,28.29 26.45,28.14 26.85,28.14 27.3,28.59 27.95,28.59 28.05,28.49 28.85,28.49 28.9,28.54 28.9,28.69

### Text on the board
tPlace: I | B | iC-MHM / Encoder For / SteadywinV3 | A | PSIN | V1.0 | PWR | NSIN | GND | ABSOLUTE | VDD | INCREMENTAL | Divide By 4 | NCOS | Divide By 2 | PCOS | No Division | ERR | NERR | !UP | !DN
bPlace: MA / NMA / NCS / SLO / NSLO / SLI / NSLI / 5V / GND | A / B / I / GND / UPCLK / DNCLK